# Altium schematic sheet 原理图.schdoc
size 309 x 223 mm; Symbol: Sheet-Symbol_A4; Device: Sheet-Symbol_A4; Company: 嘉立创EDA; Version: V1.0; Page Size: A4; @Project Name: STM32智能风扇; @Page Count: 1; @Update Date: 2024-07-11; @Create Date: 2024-07-11; @Schematic Name: STM32智能风扇; @Page No: 1; @Page Name: STM32智能风扇
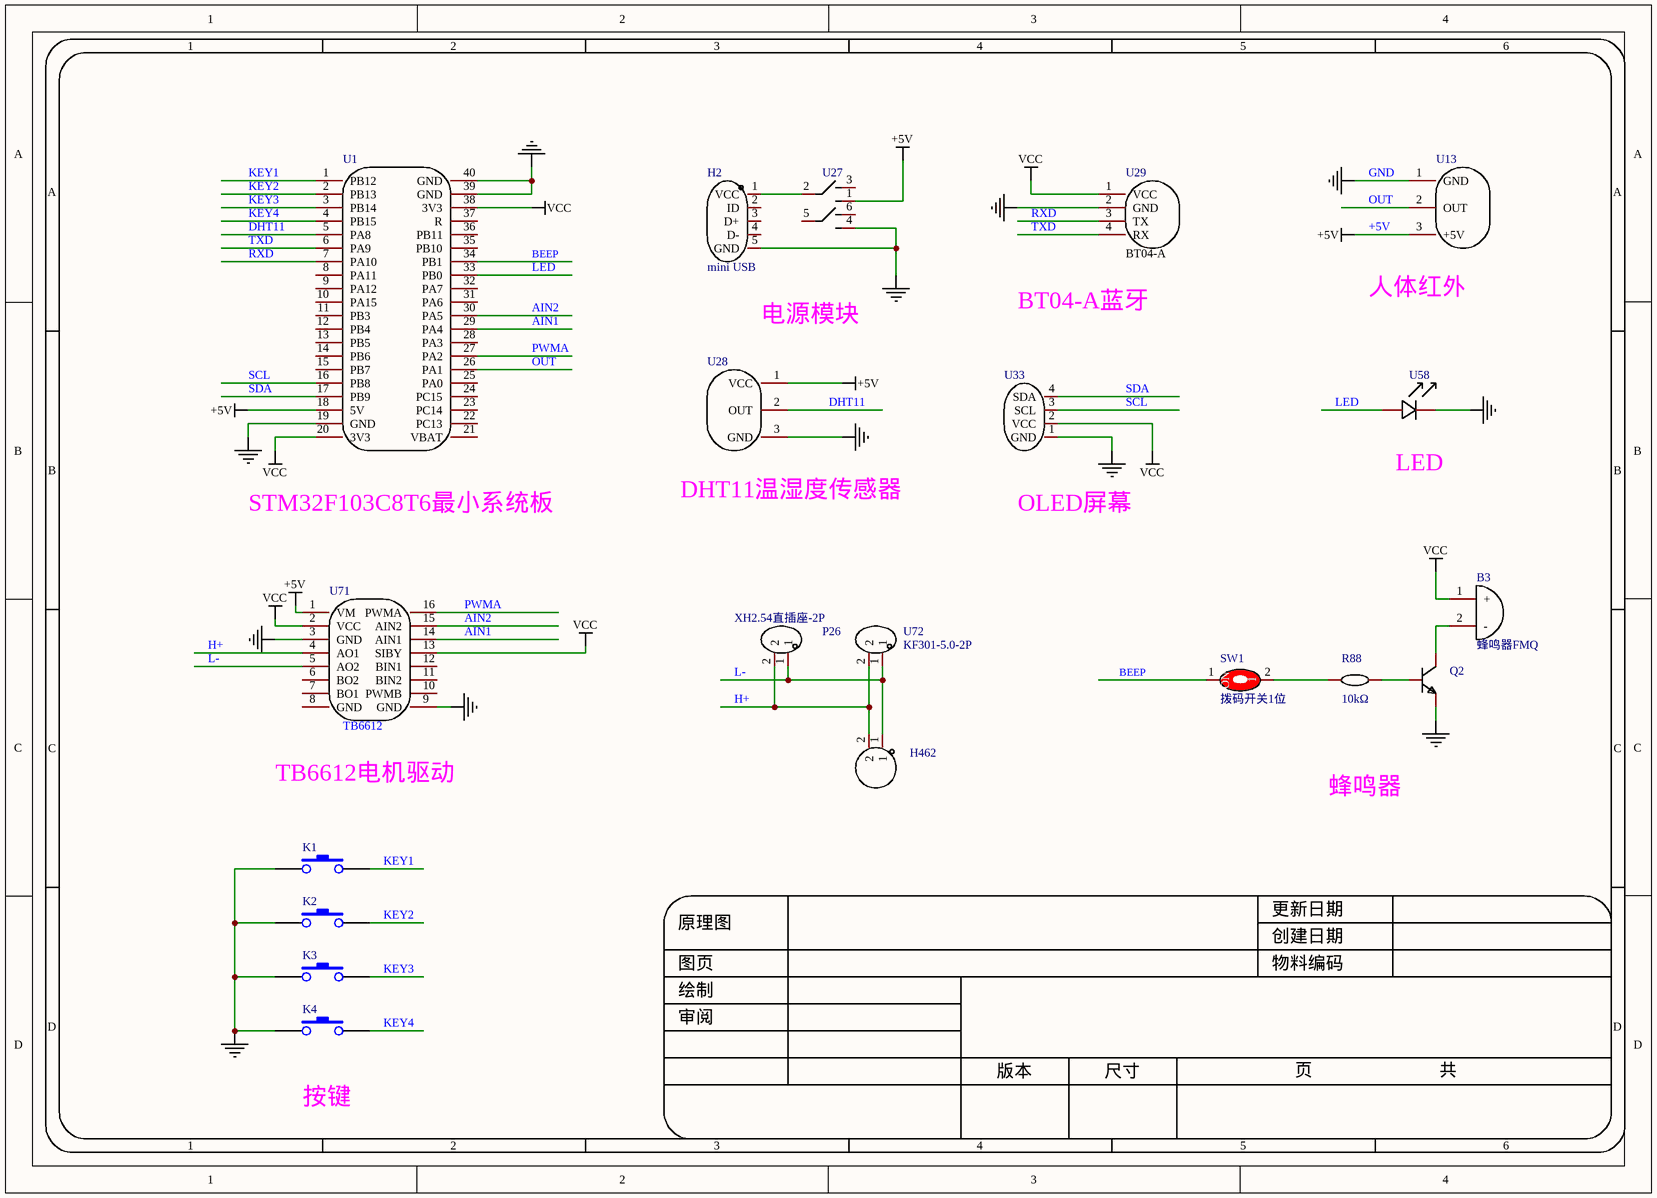
[diagram p0: 原理图.schdoc]

## Parts
(Parts that share a designator on the sheet are numbered #1, #2 ... from top to bottom, then left to right.)
B3  蜂鸣器FMQ  [蜂鸣器]
H2  mini USB  [MINI-USB-POWER]
H462  HDR-M_2.54_1x2P  [HDR-TH_2P-P2.54-V-M-1]  (value not drawn)
KEY?#1  K1  [SWT3*4]
KEY?#2  K2  [SWT3*4]
KEY?#3  K3  [SWT3*4]
KEY?#4  K4  [SWT3*4]
P26  XH2.54直插座-2P  [CONN-TH_XH2.54-2P]
Q2  S8050_TO_NPN  [S8050_TO_92]  (value not drawn)
R88  10kΩ  [Res_1/4W]
SW1  拨码开关1位  [SW-TH_DSWB01LHGET]
U1  STM32F103C8T6小蓝板  [STM32F103C8T6最小系统板(蓝)]  (value not drawn)
U13  人体红外感应传感器  [人体红外传感器]  (value not drawn)
U27  按键开关7*7  [按键开关7*7]  (value not drawn)
U28  DHT11温湿度传感器  [DHT11]  (value not drawn)
U29  BT04-A蓝牙模块  [BT04-A蓝牙模块]  (value not drawn)
U33  OLED四针0.96寸  [OLED4针0.96寸]  (value not drawn)
U58  LED_5mm  [LED_5mm]  (value not drawn)
U71  TB6612  [电机驱动模块]
U72  KF301-5.0-2P  [CONN-TH_P5.00_KF301-5.0-2P]

## Nets
+5V: U1.18(5V) U13.3(+5V) U27.1 U28.1(VCC) U71.1(VM)
GND: H2.5(GND) KEY?#1.1 KEY?#2.1 KEY?#3.1 KEY?#4.1 Q2.1(E) U1.19(GND) U1.39(GND) U1.40(GND) U13.1(GND) U27.4 U28.3(GND) U29.2(GND) U33.1(GND) U58.1(C) U71.3(GND) U71.9(GND)
VCC: B3.1(+) U1.20(3V3) U1.38(3V3) U29.1(VCC) U33.2(VCC) U71.2(VCC) U71.13(SIBY)
AIN1: U1.29(PA4) U71.14(AIN1)
AIN2: U1.30(PA5) U71.15(AIN2)
BEEP: SW1.1 U1.34(PB1)
DHT11: U1.5(PA8) U28.2(OUT)
H+: H462.2 P26.2 U71.4(AO1) U72.2
KEY1: KEY?#1.2 U1.1(PB12)
KEY2: KEY?#2.2 U1.2(PB13)
KEY3: KEY?#3.2 U1.3(PB14)
KEY4: KEY?#4.2 U1.4(PB15)
L-: H462.1 P26.1 U71.5(AO2) U72.1
LED: U1.33(PB0) U58.2(A)
OUT: U1.26(PA1) U13.2(OUT)
PWMA: U1.27(PA2) U71.16(PWMA)
RXD: U1.7(PA10) U29.3(TX)
SCL: U1.16(PB8) U33.3(SCL)
SDA: U1.17(PB9) U33.4(SDA)
TXD: U1.6(PA9) U29.4(RX)
NetB3_2: B3.2(-) Q2.3(C)
NetH2_1: H2.1(VCC) U27.2
NetQ2_2: Q2.2(B) R88.2
NetR88_1: R88.1 SW1.2

Not connected (* = marked no-connect by the designer): H2 2(ID) 3(D+) 4(D-); U1 8(PA11) 9(PA12) 10(PA15) 11(PB3) 12(PB4) 13(PB5) 14(PB6) 15(PB7) 21(VBAT) 22(PC13) 23(PC14) 24(PC15) 25(PA0) 28(PA3) 31(PA6) 32(PA7) 35(PB10) 36(PB11) 37(R); U27 3 5 6; U71 6(BO2) 7(BO1) 8(GND) 10(PWMB) 11(BIN2) 12(BIN1)

## Notes on the sheet
- 电源模块
- BT04-A蓝牙
- (near U13) 人体红外
- (near U58) LED
- STM32F103C8T6最小系统板
- (near U28) DHT11温湿度传感器
- OLED屏幕
- TB6612电机驱动
- 蜂鸣器
- 按键
- 1
- 2
- 3
- 4
- 5
- 6
- A
- B
- C
- 原理图
- 创建日期
- 更新日期
- 审阅
- 绘制
- 图页
- 物料编码
- D
- 版本
- 尺寸
- 页
- 共
- (in symbol BT04-A蓝牙模块) BT04-A
- (in symbol 拨码开关1位) ON

## Library data of the parts
B3 = 蜂鸣器FMQ: Add into BOM: yes; Name: 蜂鸣器FMQ; Symbol: 蜂鸣器FMQ; Device: 蜂鸣器FMQ; Convert to PCB: yes
H2 = mini USB: Add into BOM: yes; Reuse Block: USB-5V电源开关_1; Group ID: 1; Channel ID: $1e206; Name: mini USB; Symbol: mini USB; Device: mini USB; Convert to PCB: yes
H462 = HDR-M_2.54_1x2P: Manufacturer: Ckmtw(灿科盟); Manufacturer Part: B-2100S02P-A110; Symbol: 210S-1*2P L=11.6MMGold-plated black; Convert to PCB: yes; Device: HDR-M_2.54_1x2P; Supplier: LCSC; Supplier Part: C124375; JLCPCB Part Class: Extended Part; Add into BOM: yes; Supplier Footprint: 插件
KEY?#1-KEY?#4 = 按键
P26 = XH2.54直插座-2P: Add into BOM: yes; Name: XH2.54直插座-2P; Symbol: XH2.54直插座-2P; Device: XH2.54直插座-2P; LCSC Part Name: XH2.54直插座-2P; Supplier Part: C9900016957; Manufacturer Part: XH2.54直插座-2P; Supplier Footprint: XH2.54-2; JLCPCB Part Class: 扩展库; Datasheet: https://atta.szlcsc.comnull; Supplier: LCSC; Convert to PCB: yes
Q2 = S8050_TO_NPN: Convert to PCB: yes; Symbol: S8050_TO_NPN; Device: S8050_TO_NPN; Add into BOM: yes; Supplier Footprint: TO-92
R88 = Res_AXIAL-1/4W: Symbol: 电阻; Add into BOM: yes; Name: 10kΩ; Device: Res_AXIAL-1/4W; Supplier Footprint: 轴向引线; Convert to PCB: yes; Value: 10kΩ
U13 = 人体红外感应传感器: Add into BOM: yes; Symbol: 人体红外感应传感器; Device: 人体红外感应传感器; Convert to PCB: yes
U27 = 按键开关7*7: Add into BOM: yes; Reuse Block: USB-5V电源开关_1; Group ID: 1; Channel ID: $1e239; Symbol: 按键开关7*7; Device: 按键开关7*7; Convert to PCB: yes
U28 = DHT11温湿度传感器: Add into BOM: yes; Symbol: DHT11温湿度传感器; Device: DHT11温湿度传感器; Convert to PCB: yes
U29 = BT04-A蓝牙模块: Add into BOM: yes; Symbol: BT04-A蓝牙模块; Device: BT04-A蓝牙模块; Convert to PCB: yes
U33 = OLED四针0.96寸: Add into BOM: yes; Symbol: OLED四针0.96寸; Device: OLED四针0.96寸; Convert to PCB: yes
U58 = LED_5mm: Add into BOM: yes; Symbol: LED_5mm; Device: LED_5mm; Convert to PCB: yes
U71 = TB6612: Add into BOM: yes; Symbol: TB6612; Device: TB6612; Convert to PCB: yes
U72 = KF301-5.0-2P: Manufacturer: KEFA(科发); Add into BOM: yes; Structure: 1x2P; Pitch: 5mm; Current Rating (Max): 17A; Voltage Rating (Max): 250V; Wire Gauge - AWG: 14~22; Wire Gauge - mm2: 1.5; Number of PINs Per Row: 2; Name: KF301-5.0-2P; Symbol: KF301-5.0-2P; Device: KF301-5.0-2P; Supplier: LCSC; Supplier Part: C474881; Manufacturer Part: KF301-5.0-2P; JLCPCB Part Class: 扩展库; LCSC Part Name: 5mm 1x2P 排数:1 每排P数:2 直插; Supplier Footprint: 插件,P=5mm; Datasheet: https://atta.szlcsc.com/upload/public/pdf/source/20230317/03A5B5FC229D6F9225E8F51DA1A4E80A.pdf; Convert to PCB: yes; Color: 蓝色; Mounting Style: 直插; Number of Pins: 2P; Number of Rows: 1; Operating Temperature Range: -30℃~+120℃
SW1 = 拨码开关1位: Name: 拨码开关1位; Symbol: 拨码开关1位; Device: 拨码开关1位
U1 = STM32F103C8T6小蓝板: Symbol: STM32F103C8T6小蓝板; Device: STM32F103C8T6小蓝板